# Altium project DriveBoard.PrjPcb
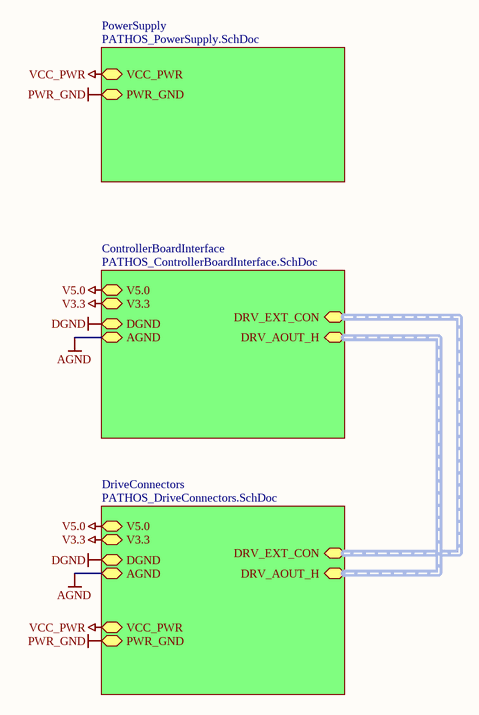
[diagram p0: PATHOS_DriveBoard.SchDoc]
5 sheets, 68 parts. Net scope: hierarchical (ports join the sheet entries above them; power ports are global).
Board file: PATHOS_DriveBoard.PcbDoc
Sheets:
  PATHOS_DriveBoard.SchDoc
    PowerSupply = PATHOS_PowerSupply.SchDoc
    ControllerBoardInterface = PATHOS_ControllerBoardInterface.SchDoc
    DriveConnectors = PATHOS_DriveConnectors.SchDoc
      Drive1 = PATHOS_Drive.SchDoc
      Drive2 = PATHOS_Drive.SchDoc
      Drive3 = PATHOS_Drive.SchDoc
      Drive4 = PATHOS_Drive.SchDoc

## Sheet PATHOS_DriveBoard.SchDoc: Drive Board for PATHOS
size A4; Author: A. Kalberer; CompanyName: NTB; DrawnBy: A. Kalberer; Organization: NTB Interstate University of Applied; Address1: Werdenbergstrasse 4; Address3: 9471 Buchs; Address4: Switzerland; DocumentNumber: 1; Revision: 0.1; SheetNumber: 1; SheetTotal: 5; Organization1: Sciences of Technology Buchs; Size: A4; ShortDescription: Main Sheet for Drive Board

### Sub-sheets
ControllerBoardInterface = PATHOS_ControllerBoardInterface.SchDoc: V5.0, V3.3, DGND, AGND, DRV_EXT_CON (harness DRV_EXT_CON), DRV_AOUT_H (harness DRV_AOUT_H)
DriveConnectors = PATHOS_DriveConnectors.SchDoc: V5.0, V3.3, DGND, AGND, VCC_PWR, PWR_GND, DRV_EXT_CON (harness DRV_EXT_CON), DRV_AOUT_H (harness DRV_AOUT_H)
PowerSupply = PATHOS_PowerSupply.SchDoc: VCC_PWR, PWR_GND

### Nets
AGND: sheet ControllerBoardInterface/AGND, sheet DriveConnectors/AGND
DGND: sheet ControllerBoardInterface/DGND, sheet DriveConnectors/DGND
PWR_GND: sheet PowerSupply/PWR_GND, sheet DriveConnectors/PWR_GND
V3.3: sheet ControllerBoardInterface/V3.3, sheet DriveConnectors/V3.3
V5.0: sheet ControllerBoardInterface/V5.0, sheet DriveConnectors/V5.0
VCC_PWR: sheet PowerSupply/VCC_PWR, sheet DriveConnectors/VCC_PWR

### Buses and harness runs
harness sheet ControllerBoardInterface/DRV_AOUT_H = sheet DriveConnectors/DRV_AOUT_H
harness sheet ControllerBoardInterface/DRV_EXT_CON = sheet DriveConnectors/DRV_EXT_CON

### Notes on the sheet
- Title:
- Description:
- Size:
- Date:
- Name:
- Number:
- Time:
- Revision:
- Sheet
- Checked:
- of
- File:

## Sheet PATHOS_PowerSupply.SchDoc: Motor/Drive Power Supply
size A4; Author: A. Kalberer; CompanyName: NTB; Organization: NTB Interstate University of Applied; Address1: Werdenbergstrasse 4; Address3: 9471 Buchs; Address4: Switzerland; DocumentNumber: 2; Revision: 0.1; SheetNumber: 2; SheetTotal: 5; Organization1: Sciences of Technology Buchs; Size: A4
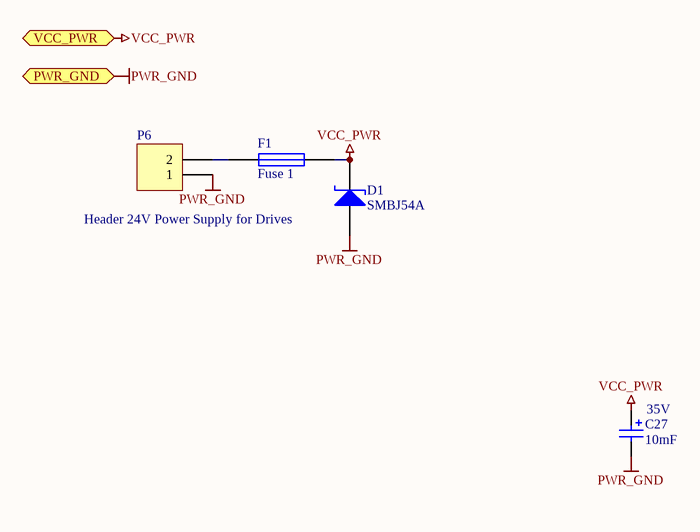
[diagram p1: PATHOS_PowerSupply.SchDoc]

### Parts
C27  Voltage Maxium: 35V  [Cap_SLP_C7_10mF]  (hidden comment: 10mF)
D1  SMBJ54A  [TVS_DO214AA]
F1  Fuse 1  [Fuse40ASMD]
P6  Header 24V Power Supply for Drives  [PhoenixHeader5_08_Vertical_unsymetric]

### Ports
PWR_GND, VCC_PWR

### Nets
PWR_GND: C27.2(Neg) D1.A P6.1 ; port PWR_GND
VCC_PWR: C27.1(Pos) D1.K F1.2 ; port VCC_PWR
NetF1_1: F1.1 P6.2

### Notes on the sheet
- Title:
- Description:
- Size:
- Date:
- Name:
- Number:
- Time:
- Revision:
- Sheet
- Checked:
- of
- File:

### Library data of the parts
C27 = C_POL: Polarized Capacitor Positive Mark Bar; #Manufacturer: Generic Components; #Publisher: Dr. A. Heinzelmann; #Class: Passive; Initial Voltage: 0V; #Published: 2006-10-07; #ClassSub: Capacitor; Type: *; Value: 10mF
D1 = Diode SMBJ54A: TVS Diode; Published: 8-Jun-2000; PackageVersion: Feb-1998; PackageReference: TO-220AC; Publisher: Altium Limited; PackageDescription: TO, Thru-Hole, Vertical, Heatsink Mounted; 3 In-Line Leads (1 Absent); Pitch 2.54 mm
F1 = Fuse 1: Fuse; Published: 8-Jun-2000; LatestRevisionDate: 17-Jul-2002; LatestRevisionNote: Re-released for DXP Platform.; PackageReference: PIN-W2/E2.8; Publisher: Altium Limited; PackageDescription: Thru-Hole; 2 Leads
P6 = Header 2: Header, 2-Pin; LatestRevisionDate: 17-Jul-2002; LatestRevisionNote: Re-released for DXP Platform.; Publisher: Altium Limited

## Sheet PATHOS_ControllerBoardInterface.SchDoc: Connector to Controller Board
size A4; Author: A. Kalberer; CompanyName: NTB; Organization: NTB Interstate University of Applied; Address1: Werdenbergstrasse 4; Address3: 9471 Buchs; Address4: Switzerland; DocumentNumber: 5; Revision: 0.1; SheetNumber: 5; SheetTotal: 5; Organization1: Sciences of Technology Buchs; Size: A4; ShortDescription: + PowerSupply for 3.3V and 5V from Controller Board
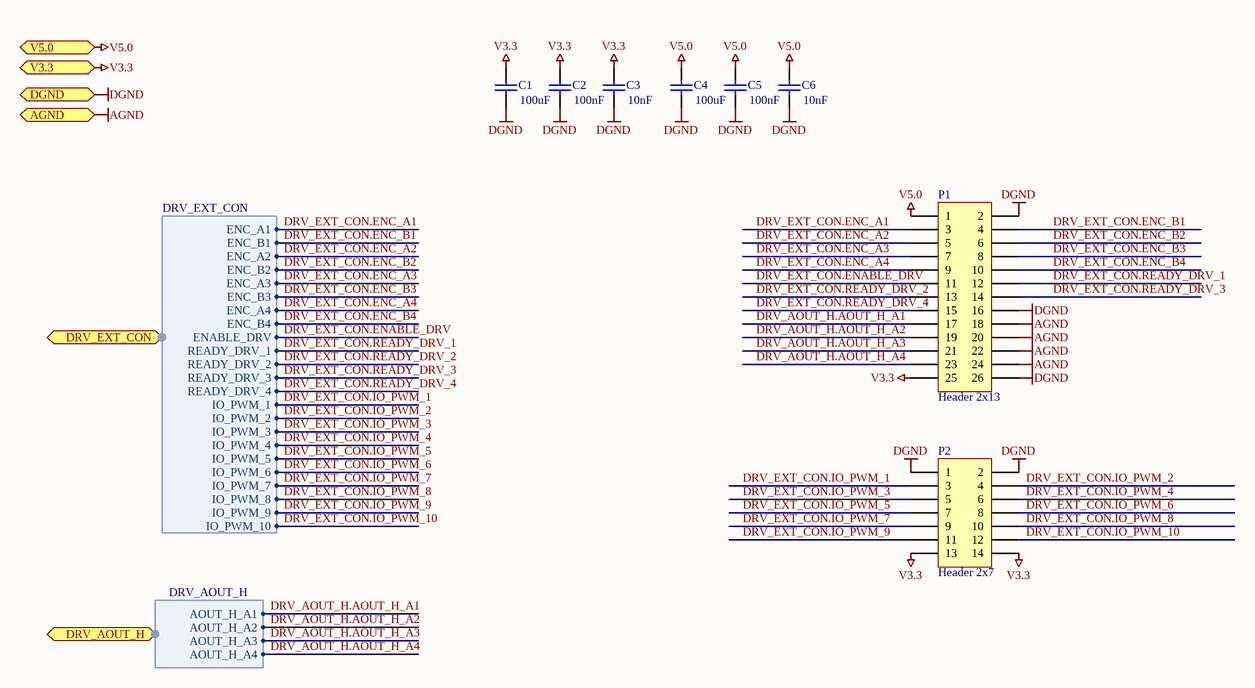
[diagram p2: PATHOS_ControllerBoardInterface.SchDoc]

### Parts
C1  value 100uF  [1812]  (hidden comment: Cap)
C2  value 100nF  [0603_3D]  (hidden comment: Cap)
C3  value 10nF  [0603_3D]  (hidden comment: Cap)
C4  value 100uF  [1812]  (hidden comment: Cap)
C5  value 100nF  [0603_3D]  (hidden comment: Cap)
C6  value 10nF  [0603_3D]  (hidden comment: Cap)
P1  Header 2x13  [Wannenstecker26Pol]
P2  Header 2x7  [Wannenstecker14Pol]

### Ports
AGND, DGND, DRV_AOUT_H (harness DRV_AOUT_H), DRV_EXT_CON (harness DRV_EXT_CON), V3.3, V5.0

### Harnesses
DRV_EXT_CON: ENC_A1, ENC_B1, ENC_A2, ENC_B2, ENC_A3, ENC_B3, ENC_A4, ENC_B4, ENABLE_DRV, IO_PWM_1, IO_PWM_2, IO_PWM_3, IO_PWM_4, IO_PWM_5, IO_PWM_6, IO_PWM_7, IO_PWM_8, READY_DRV_1, READY_DRV_2, READY_DRV_3, READY_DRV_4, IO_PWM_9, IO_PWM_10
DRV_AOUT_H: AOUT_H_A1, AOUT_H_A2, AOUT_H_A3, AOUT_H_A4

### Nets
AGND: P1.18 P1.20 P1.22 P1.24 ; port AGND
DGND: C1.1 C2.1 C3.1 C4.1 C5.1 C6.1 P1.2 P1.16 P1.26 P2.1 P2.2 ; port DGND
V3.3: C1.2 C2.2 C3.2 P1.25 P2.13 P2.14 ; port V3.3
V5.0: C4.2 C5.2 C6.2 P1.1 ; port V5.0
DRV_AOUT_H.AOUT_H_A1: P1.17 ; port DRV_AOUT_H.AOUT_H_A1  [project net DRV_AOUT_H.AOUT_H_A]
DRV_AOUT_H.AOUT_H_A2: P1.19 ; port DRV_AOUT_H.AOUT_H_A2  [project net DRV_AOUT_H.AOUT_H_A]
DRV_AOUT_H.AOUT_H_A3: P1.21 ; port DRV_AOUT_H.AOUT_H_A3  [project net DRV_AOUT_H.AOUT_H_A]
DRV_AOUT_H.AOUT_H_A4: P1.23 ; port DRV_AOUT_H.AOUT_H_A4  [project net DRV_AOUT_H.AOUT_H_A]
DRV_EXT_CON.ENABLE_DRV: P1.11 ; port DRV_EXT_CON.ENABLE_DRV
DRV_EXT_CON.ENC_A1: P1.3 ; port DRV_EXT_CON.ENC_A1
DRV_EXT_CON.ENC_A2: P1.5 ; port DRV_EXT_CON.ENC_A2
DRV_EXT_CON.ENC_A3: P1.7 ; port DRV_EXT_CON.ENC_A3
DRV_EXT_CON.ENC_A4: P1.9 ; port DRV_EXT_CON.ENC_A4
DRV_EXT_CON.ENC_B1: P1.4 ; port DRV_EXT_CON.ENC_B1
DRV_EXT_CON.ENC_B2: P1.6 ; port DRV_EXT_CON.ENC_B2
DRV_EXT_CON.ENC_B3: P1.8 ; port DRV_EXT_CON.ENC_B3
DRV_EXT_CON.ENC_B4: P1.10 ; port DRV_EXT_CON.ENC_B4
DRV_EXT_CON.IO_PWM_1: P2.3 ; port DRV_EXT_CON.IO_PWM_1
DRV_EXT_CON.IO_PWM_2: P2.4 ; port DRV_EXT_CON.IO_PWM_2
DRV_EXT_CON.IO_PWM_3: P2.5 ; port DRV_EXT_CON.IO_PWM_3
DRV_EXT_CON.IO_PWM_4: P2.6 ; port DRV_EXT_CON.IO_PWM_4
DRV_EXT_CON.IO_PWM_5: P2.7 ; port DRV_EXT_CON.IO_PWM_5
DRV_EXT_CON.IO_PWM_6: P2.8 ; port DRV_EXT_CON.IO_PWM_6
DRV_EXT_CON.IO_PWM_7: P2.9 ; port DRV_EXT_CON.IO_PWM_7
DRV_EXT_CON.IO_PWM_8: P2.10 ; port DRV_EXT_CON.IO_PWM_8
DRV_EXT_CON.IO_PWM_9: P2.11 ; port DRV_EXT_CON.IO_PWM_9
DRV_EXT_CON.IO_PWM_10: P2.12 ; port DRV_EXT_CON.IO_PWM_10
DRV_EXT_CON.READY_DRV_1: P1.12 ; port DRV_EXT_CON.READY_DRV_1
DRV_EXT_CON.READY_DRV_2: P1.13 ; port DRV_EXT_CON.READY_DRV_2
DRV_EXT_CON.READY_DRV_3: P1.14 ; port DRV_EXT_CON.READY_DRV_3
DRV_EXT_CON.READY_DRV_4: P1.15 ; port DRV_EXT_CON.READY_DRV_4

### Notes on the sheet
- Title:
- Description:
- Size:
- Date:
- Name:
- Number:
- Time:
- Revision:
- Sheet
- Checked:
- of
- File:

### Library data of the parts
C1-C6 = Cap: Capacitor; Published: 8-Jun-2000; LatestRevisionDate: 17-Jul-2002; LatestRevisionNote: Re-released for DXP Platform.; PackageReference: RAD-0.3; Publisher: Altium Limited; PackageDescription: Radial Cap, Thru-Hole; 2 Leads; 0.3 in Pin Spacing
P1 = Header 2x13: Header, 13-Pin, Dual row; LatestRevisionDate: 17-Jul-2002; LatestRevisionNote: Re-released for DXP Platform.; Publisher: Altium Limited
P2 = Header 2x7: Header, 7-Pin, Dual row; LatestRevisionDate: 17-Jul-2002; LatestRevisionNote: Re-released for DXP Platform.; Publisher: Altium Limited

## Sheet PATHOS_DriveConnectors.SchDoc: Drive Signal Distribution
size A4; Author: A. Kalberer; CompanyName: NTB; Organization: NTB Interstate University of Applied; Address1: Werdenbergstrasse 4; Address3: 9471 Buchs; Address4: Switzerland; DocumentNumber: 3; Revision: 0.1; SheetNumber: 3; SheetTotal: 5; Organization1: Sciences of Technology Buchs; Size: A4; ShortDescription: Level Shifter and Line Receiver for Drive Connector
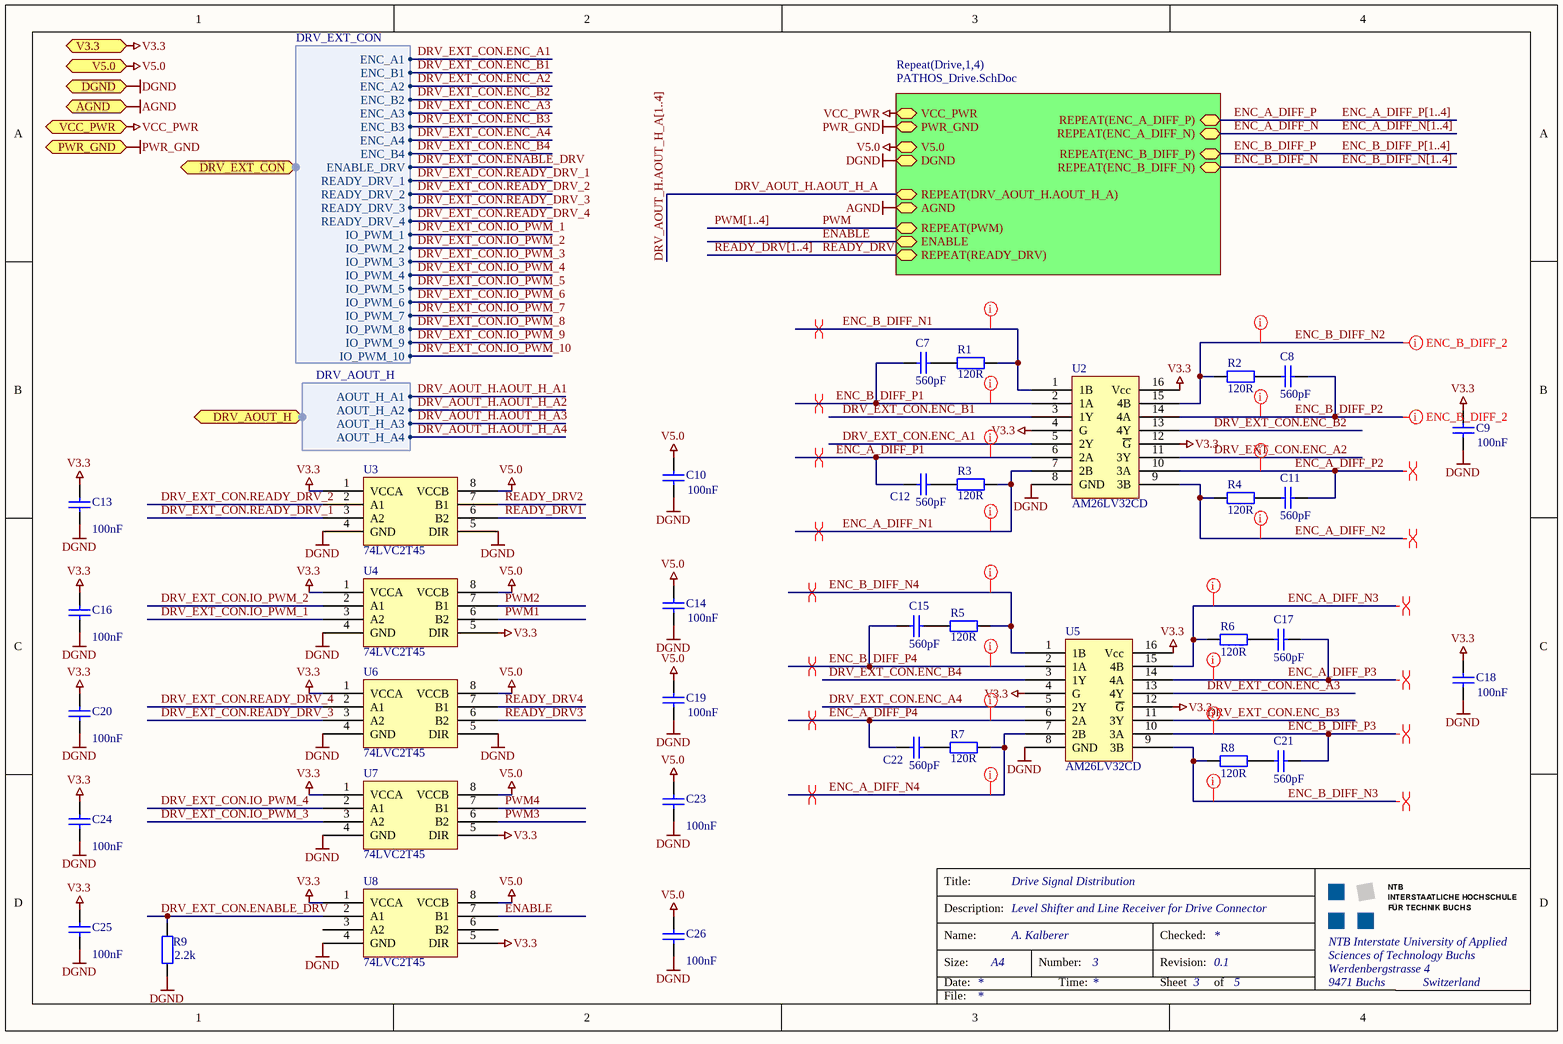
[diagram p3: PATHOS_DriveConnectors.SchDoc]

### Parts
C7  value 560pF  [0603_3D]  (hidden comment: Cap)
C8  value 560pF  [0603_3D]  (hidden comment: Cap)
C9  value 100nF  [0603_3D]  (hidden comment: Cap)
C10  value 100nF  [0603_3D]  (hidden comment: Cap)
C11  value 560pF  [0603_3D]  (hidden comment: Cap)
C12  value 560pF  [0603_3D]  (hidden comment: Cap)
C13  value 100nF  [0603_3D]  (hidden comment: Cap)
C14  value 100nF  [0603_3D]  (hidden comment: Cap)
C15  value 560pF  [0603_3D]  (hidden comment: Cap)
C16  value 100nF  [0603_3D]  (hidden comment: Cap)
C17  value 560pF  [0603_3D]  (hidden comment: Cap)
C18  value 100nF  [0603_3D]  (hidden comment: Cap)
C19  value 100nF  [0603_3D]  (hidden comment: Cap)
C20  value 100nF  [0603_3D]  (hidden comment: Cap)
C21  value 560pF  [0603_3D]  (hidden comment: Cap)
C22  value 560pF  [0603_3D]  (hidden comment: Cap)
C23  value 100nF  [0603_3D]  (hidden comment: Cap)
C24  value 100nF  [0603_3D]  (hidden comment: Cap)
C25  value 100nF  [0603_3D]  (hidden comment: Cap)
C26  value 100nF  [0603_3D]  (hidden comment: Cap)
R1  value 120R  [0603_3D]  (hidden comment: Res2)
R2  value 120R  [0603_3D]  (hidden comment: Res2)
R3  value 120R  [0603_3D]  (hidden comment: Res2)
R4  value 120R  [0603_3D]  (hidden comment: Res2)
R5  value 120R  [0603_3D]  (hidden comment: Res2)
R6  value 120R  [0603_3D]  (hidden comment: Res2)
R7  value 120R  [0603_3D]  (hidden comment: Res2)
R8  value 120R  [0603_3D]  (hidden comment: Res2)
R9  value 2.2k  [0603_3D]  (hidden comment: Res2)
U2  AM26LV32CD  [SOP16]
U3  74LVC2T45  [74LVC2T45]
U4  74LVC2T45  [74LVC2T45]
U5  AM26LV32CD  [SOP16]
U6  74LVC2T45  [74LVC2T45]
U7  74LVC2T45  [74LVC2T45]
U8  74LVC2T45  [74LVC2T45]

### Sub-sheets
Repeat(Drive,1,4) = PATHOS_Drive.SchDoc: VCC_PWR, PWR_GND, V5.0, DGND, REPEAT(DRV_AOUT_H.AOUT_H_A), AGND, REPEAT(ENC_A_DIFF_P), REPEAT(ENC_A_DIFF_N), REPEAT(ENC_B_DIFF_P), REPEAT(ENC_B_DIFF_N), REPEAT(PWM), ENABLE, REPEAT(READY_DRV)

### Ports
AGND, DGND, DRV_AOUT_H (harness DRV_AOUT_H), DRV_EXT_CON (harness DRV_EXT_CON), PWR_GND, V3.3, V5.0, VCC_PWR

### Harnesses
DRV_EXT_CON: ENC_A1, ENC_B1, ENC_A2, ENC_B2, ENC_A3, ENC_B3, ENC_A4, ENC_B4, ENABLE_DRV, IO_PWM_1, IO_PWM_2, IO_PWM_3, IO_PWM_4, IO_PWM_5, IO_PWM_6, IO_PWM_7, IO_PWM_8, READY_DRV_1, READY_DRV_2, READY_DRV_3, READY_DRV_4, IO_PWM_9, IO_PWM_10
DRV_AOUT_H: AOUT_H_A1, AOUT_H_A2, AOUT_H_A3, AOUT_H_A4

### Nets
AGND: port AGND, sheet Repeat(Drive,1,4)/AGND
DGND: C9.1 C10.1 C13.1 C14.1 C16.1 C18.1 C19.1 C20.1 C23.1 C24.1 C25.1 C26.1 R9.1 U2.8(GND) U3.4(GND) U3.5(DIR) U4.4(GND) U5.8(GND) U6.4(GND) U6.5(DIR) U7.4(GND) U8.4(GND) ; port DGND, sheet Repeat(Drive,1,4)/DGND
PWR_GND: port PWR_GND, sheet Repeat(Drive,1,4)/PWR_GND
V3.3: C9.2 C13.2 C16.2 C18.2 C20.2 C24.2 C25.2 U2.4(G) U2.12(~{G}) U2.16(Vcc) U3.1(VCCA) U4.1(VCCA) U4.5(DIR) U5.4(G) U5.12(~{G}) U5.16(Vcc) U6.1(VCCA) U7.1(VCCA) U7.5(DIR) U8.1(VCCA) U8.5(DIR) ; port V3.3
V5.0: C10.2 C14.2 C19.2 C23.2 C26.2 U3.8(VCCB) U4.8(VCCB) U6.8(VCCB) U7.8(VCCB) U8.8(VCCB) ; port V5.0, sheet Repeat(Drive,1,4)/V5.0
VCC_PWR: port VCC_PWR, sheet Repeat(Drive,1,4)/VCC_PWR
DRV_AOUT_H.AOUT_H_A: sheet Repeat(Drive,1,4)/REPEAT(DRV_AOUT_H.AOUT_H_A)
DRV_EXT_CON.ENABLE_DRV: R9.2 U8.2(A1) ; port DRV_EXT_CON.ENABLE_DRV
DRV_EXT_CON.ENC_A1: U2.5(2Y) ; port DRV_EXT_CON.ENC_A1
DRV_EXT_CON.ENC_A2: U2.11(3Y) ; port DRV_EXT_CON.ENC_A2
DRV_EXT_CON.ENC_A3: U5.13(4Y) ; port DRV_EXT_CON.ENC_A3
DRV_EXT_CON.ENC_A4: U5.5(2Y) ; port DRV_EXT_CON.ENC_A4
DRV_EXT_CON.ENC_B1: U2.3(1Y) ; port DRV_EXT_CON.ENC_B1
DRV_EXT_CON.ENC_B2: U2.13(4Y) ; port DRV_EXT_CON.ENC_B2
DRV_EXT_CON.ENC_B3: U5.11(3Y) ; port DRV_EXT_CON.ENC_B3
DRV_EXT_CON.ENC_B4: U5.3(1Y) ; port DRV_EXT_CON.ENC_B4
DRV_EXT_CON.IO_PWM_1: U4.3(A2) ; port DRV_EXT_CON.IO_PWM_1
DRV_EXT_CON.IO_PWM_2: U4.2(A1) ; port DRV_EXT_CON.IO_PWM_2
DRV_EXT_CON.IO_PWM_3: U7.3(A2) ; port DRV_EXT_CON.IO_PWM_3
DRV_EXT_CON.IO_PWM_4: U7.2(A1) ; port DRV_EXT_CON.IO_PWM_4
DRV_EXT_CON.READY_DRV_1: U3.3(A2) ; port DRV_EXT_CON.READY_DRV_1
DRV_EXT_CON.READY_DRV_2: U3.2(A1) ; port DRV_EXT_CON.READY_DRV_2
DRV_EXT_CON.READY_DRV_3: U6.3(A2) ; port DRV_EXT_CON.READY_DRV_3
DRV_EXT_CON.READY_DRV_4: U6.2(A1) ; port DRV_EXT_CON.READY_DRV_4
ENABLE: U8.7(B1) ; sheet Repeat(Drive,1,4)/ENABLE
ENC_A_DIFF_N: sheet Repeat(Drive,1,4)/REPEAT(ENC_A_DIFF_N)
ENC_A_DIFF_N1: R3.1 U2.7(2B)  [project net ENC_A_DIFF_N]
ENC_A_DIFF_N2: R4.1 U2.9(3B)  [project net ENC_A_DIFF_N]
ENC_A_DIFF_N3: R6.1 U5.15(4B)  [project net ENC_A_DIFF_N]
ENC_A_DIFF_N4: R7.1 U5.7(2B)  [project net ENC_A_DIFF_N]
ENC_A_DIFF_P: sheet Repeat(Drive,1,4)/REPEAT(ENC_A_DIFF_P)
ENC_A_DIFF_P1: C12.2 U2.6(2A)  [project net ENC_A_DIFF_P]
ENC_A_DIFF_P2: C11.1 U2.10(3A)  [project net ENC_A_DIFF_P]
ENC_A_DIFF_P3: C17.1 U5.14(4A)  [project net ENC_A_DIFF_P]
ENC_A_DIFF_P4: C22.2 U5.6(2A)  [project net ENC_A_DIFF_P]
ENC_B_DIFF_N: sheet Repeat(Drive,1,4)/REPEAT(ENC_B_DIFF_N)
ENC_B_DIFF_N1: R1.1 U2.1(1B)  [project net ENC_B_DIFF_N]
ENC_B_DIFF_N2: R2.1 U2.15(4B)  [project net ENC_B_DIFF_N]
ENC_B_DIFF_N3: R8.1 U5.9(3B)  [project net ENC_B_DIFF_N]
ENC_B_DIFF_N4: R5.1 U5.1(1B)  [project net ENC_B_DIFF_N]
ENC_B_DIFF_P: sheet Repeat(Drive,1,4)/REPEAT(ENC_B_DIFF_P)
ENC_B_DIFF_P1: C7.2 U2.2(1A)  [project net ENC_B_DIFF_P]
ENC_B_DIFF_P2: C8.1 U2.14(4A)  [project net ENC_B_DIFF_P]
ENC_B_DIFF_P3: C21.1 U5.10(3A)  [project net ENC_B_DIFF_P]
ENC_B_DIFF_P4: C15.2 U5.2(1A)  [project net ENC_B_DIFF_P]
PWM: sheet Repeat(Drive,1,4)/REPEAT(PWM)
PWM1: U4.6(B2)  [project net PWM]
PWM2: U4.7(B1)  [project net PWM]
PWM3: U7.6(B2)  [project net PWM]
PWM4: U7.7(B1)  [project net PWM]
READY_DRV: sheet Repeat(Drive,1,4)/REPEAT(READY_DRV)
READY_DRV1: U3.6(B2)  [project net READY_DRV]
READY_DRV2: U3.7(B1)  [project net READY_DRV]
READY_DRV3: U6.6(B2)  [project net READY_DRV]
READY_DRV4: U6.7(B1)  [project net READY_DRV]
NetC7_1: C7.1 R1.2
NetC8_2: C8.2 R2.2
NetC11_2: C11.2 R4.2
NetC12_1: C12.1 R3.2
NetC15_1: C15.1 R5.2
NetC17_2: C17.2 R6.2
NetC21_2: C21.2 R8.2
NetC22_1: C22.1 R7.2

Not connected (* = marked no-connect by the designer): U8 3(A2) 6(B2)

### Buses and harness runs
bus DRV_AOUT_H.AOUT_H_A[1..4]
bus ENC_A_DIFF_N[1..4]
bus ENC_A_DIFF_P[1..4]
bus ENC_B_DIFF_N[1..4]
bus ENC_B_DIFF_P[1..4]
bus PWM[1..4]
bus READY_DRV[1..4]

### Layout directives
differential pair: ENC_A_DIFF_N, ENC_A_DIFF_P, ENC_B_DIFF_N, ENC_B_DIFF_P
net class ENC_A_DIFF_1: ENC_A_DIFF_N, ENC_A_DIFF_P
net class ENC_B_DIFF_1: ENC_B_DIFF_N, ENC_B_DIFF_P
net class ENC_A_DIFF_2: ENC_A_DIFF_N, ENC_A_DIFF_P
net class ENC_B_DIFF_2: ENC_B_DIFF_N, ENC_B_DIFF_P
net class ENC_B_DIFF_4: ENC_B_DIFF_N, ENC_B_DIFF_P
net class ENC_A_DIFF_4: ENC_A_DIFF_N, ENC_A_DIFF_P
net class ENC_B_DIFF_3: ENC_B_DIFF_N, ENC_B_DIFF_P
net class ENC_A_DIFF_3: ENC_A_DIFF_N, ENC_A_DIFF_P

### Notes on the sheet
- Title:
- Description:
- Size:
- Date:
- Name:
- Number:
- Time:
- Revision:
- Sheet
- Checked:
- of
- File:

### Library data of the parts
C7-C26 = Cap: Capacitor; Published: 8-Jun-2000; LatestRevisionDate: 17-Jul-2002; LatestRevisionNote: Re-released for DXP Platform.; PackageReference: RAD-0.3; Publisher: Altium Limited; PackageDescription: Radial Cap, Thru-Hole; 2 Leads; 0.3 in Pin Spacing
R1-R9 = Res2: Resistor; Published: 8-Jun-2000; LatestRevisionDate: 17-Jul-2002; LatestRevisionNote: Re-released for DXP Platform.; PackageReference: AXIAL-0.4; Publisher: Altium Limited; PackageDescription: Axial Device, Thru-Hole; 2 Leads; 0.4 in Pin Spacing
U3 U4 U6-U8 = 74LVC2T45: SN74LVC2T45DCTR

## Sheet PATHOS_Drive.SchDoc: Maxon Drive Connector
size A4; Author: A. Kalberer; CompanyName: NTB; Organization: NTB Interstate University of Applied; Address1: Werdenbergstrasse 4; Address3: 9471 Buchs; Address4: Switzerland; DocumentNumber: 4; Revision: 0.1; SheetNumber: 4; SheetTotal: 5; Organization1: Sciences of Technology Buchs; Size: A4; ShortDescription: Connector for ESCON 50/5
Used 4 times, as channels DriveConnectors/Drive1, DriveConnectors/Drive2, DriveConnectors/Drive3, DriveConnectors/Drive4. Parts and nets are listed once, with the designators drawn on the sheet.
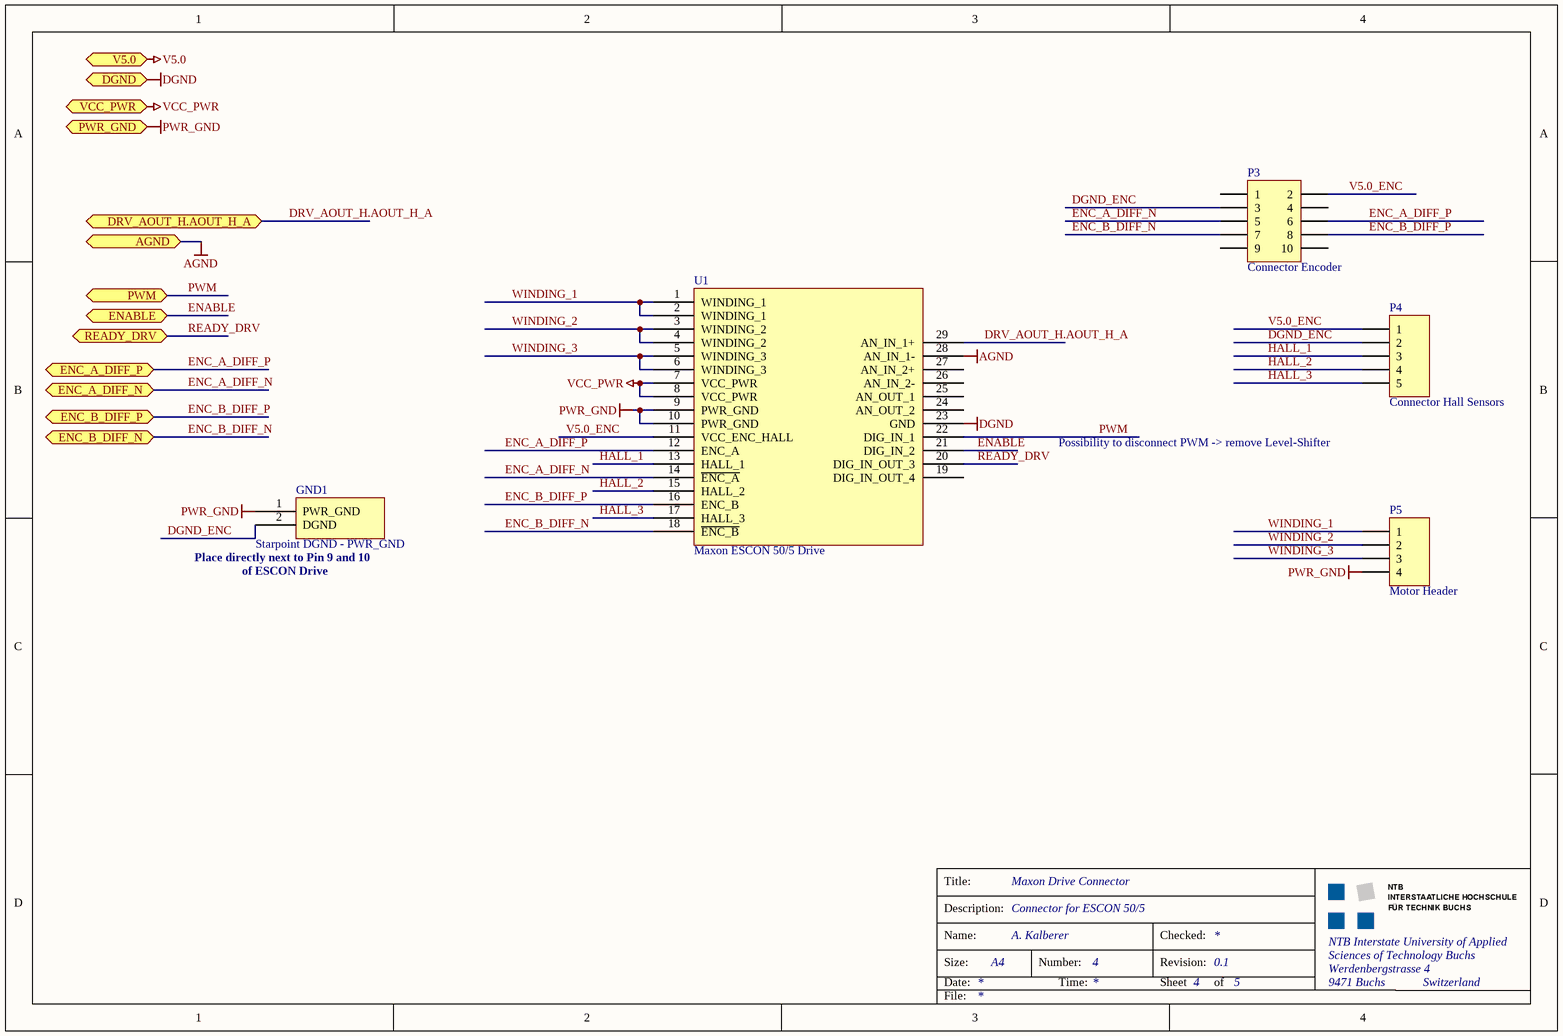
[diagram p4: PATHOS_Drive.SchDoc]

### Parts
GND1  Starpoint DGND - PWR_GND  [NetTiePWRGND]  (net tie, no BOM)
P3  Connector Encoder  [Wannenstecker 2x5 - H]
P4  Connector Hall Sensors  [PhoenixHeaderScrew_3_5mm_5pol]
P5  Motor Header  [PhoenixHeaderScrew_3_5mm_4pol]
U1  Maxon ESCON 50/5 Drive  [ESCON_MODULE_50/5]

### Ports
AGND, DGND, DRV_AOUT_H.AOUT_H_A, ENABLE, ENC_A_DIFF_N, ENC_A_DIFF_P, ENC_B_DIFF_N, ENC_B_DIFF_P, PWM, PWR_GND, READY_DRV, V5.0, VCC_PWR

### Nets
AGND: U1.28(AN_IN_1-) ; port AGND
DGND: U1.23(GND) ; port DGND
PWR_GND: GND1.1(PWR_GND) P5.4 U1.9(PWR_GND) U1.10(PWR_GND) ; port PWR_GND
V5.0: port V5.0
VCC_PWR: U1.7(VCC_PWR) U1.8(VCC_PWR) ; port VCC_PWR
DGND_ENC: GND1.2(DGND) P3.3 P4.2
DRV_AOUT_H.AOUT_H_A: U1.29(AN_IN_1+) ; port DRV_AOUT_H.AOUT_H_A
ENABLE: U1.21(DIG_IN_2) ; port ENABLE
ENC_A_DIFF_N: P3.5 U1.14(~{ENC_A}) ; port ENC_A_DIFF_N
ENC_A_DIFF_P: P3.6 U1.12(ENC_A) ; port ENC_A_DIFF_P
ENC_B_DIFF_N: P3.7 U1.18(~{ENC_B}) ; port ENC_B_DIFF_N
ENC_B_DIFF_P: P3.8 U1.16(ENC_B) ; port ENC_B_DIFF_P
HALL_1: P4.3 U1.13(HALL_1)
HALL_2: P4.4 U1.15(HALL_2)
HALL_3: P4.5 U1.17(HALL_3)
PWM: U1.22(DIG_IN_1) ; port PWM
READY_DRV: U1.20(DIG_IN_OUT_3) ; port READY_DRV
V5.0_ENC: P3.2 P4.1 U1.11(VCC_ENC_HALL)
WINDING_1: P5.1 U1.1(WINDING_1) U1.2(WINDING_1)
WINDING_2: P5.2 U1.3(WINDING_2) U1.4(WINDING_2)
WINDING_3: P5.3 U1.5(WINDING_3) U1.6(WINDING_3)

Not connected (* = marked no-connect by the designer): P3 1 4 9 10; U1 19(DIG_IN_OUT_4) 24(AN_OUT_2) 25(AN_OUT_1) 26(AN_IN_2-) 27(AN_IN_2+)

### Channels
DriveConnectors/Drive1: designators end in _Drive1; ports AGND=AGND DGND=DGND DRV_AOUT_H.AOUT_H_A=DRV_AOUT_H.AOUT_H_A ENABLE=ENABLE ENC_A_DIFF_N=ENC_A_DIFF_N ENC_A_DIFF_P=ENC_A_DIFF_P ENC_B_DIFF_N=ENC_B_DIFF_N ENC_B_DIFF_P=ENC_B_DIFF_P PWM=PWM PWR_GND=PWR_GND READY_DRV=READY_DRV V5.0=V5.0 VCC_PWR=VCC_PWR
DriveConnectors/Drive2: designators end in _Drive2; ports AGND=AGND DGND=DGND DRV_AOUT_H.AOUT_H_A=DRV_AOUT_H.AOUT_H_A ENABLE=ENABLE ENC_A_DIFF_N=ENC_A_DIFF_N ENC_A_DIFF_P=ENC_A_DIFF_P ENC_B_DIFF_N=ENC_B_DIFF_N ENC_B_DIFF_P=ENC_B_DIFF_P PWM=PWM PWR_GND=PWR_GND READY_DRV=READY_DRV V5.0=V5.0 VCC_PWR=VCC_PWR
DriveConnectors/Drive3: designators end in _Drive3; ports AGND=AGND DGND=DGND DRV_AOUT_H.AOUT_H_A=DRV_AOUT_H.AOUT_H_A ENABLE=ENABLE ENC_A_DIFF_N=ENC_A_DIFF_N ENC_A_DIFF_P=ENC_A_DIFF_P ENC_B_DIFF_N=ENC_B_DIFF_N ENC_B_DIFF_P=ENC_B_DIFF_P PWM=PWM PWR_GND=PWR_GND READY_DRV=READY_DRV V5.0=V5.0 VCC_PWR=VCC_PWR
DriveConnectors/Drive4: designators end in _Drive4; ports AGND=AGND DGND=DGND DRV_AOUT_H.AOUT_H_A=DRV_AOUT_H.AOUT_H_A ENABLE=ENABLE ENC_A_DIFF_N=ENC_A_DIFF_N ENC_A_DIFF_P=ENC_A_DIFF_P ENC_B_DIFF_N=ENC_B_DIFF_N ENC_B_DIFF_P=ENC_B_DIFF_P PWM=PWM PWR_GND=PWR_GND READY_DRV=READY_DRV V5.0=V5.0 VCC_PWR=VCC_PWR

### Notes on the sheet
- Possibility to disconnect PWM -> remove Level-Shifter
- (near GND1) Place directly next to Pin 9 and 10
- (near GND1) of ESCON Drive
- Title:
- Description:
- Size:
- Date:
- Name:
- Number:
- Time:
- Revision:
- Sheet
- Checked:
- of
- File:

### Library data of the parts
GND1 = NetTie_PWR_GND
P3 = Header 5X2: Header, 5-Pin, Dual row; LatestRevisionDate: 17-Jul-2002; LatestRevisionNote: Re-released for DXP Platform.; Publisher: Altium Limited
P4 = Header 5: Header, 5-Pin; LatestRevisionDate: 17-Jul-2002; LatestRevisionNote: Re-released for DXP Platform.; Publisher: Altium Limited
P5 = Header 4: Header, 4-Pin; LatestRevisionDate: 17-Jul-2002; LatestRevisionNote: Re-released for DXP Platform.; Publisher: Altium Limited
U1 = DRV_ESCON_50_5: Maxon Drive 4Q

## Nets that join several sheets
AGND: PATHOS_ControllerBoardInterface (P1.18 P1.20 P1.22 P1.24), DriveConnectors/Drive1 (U1_Drive1.28), DriveConnectors/Drive2 (U1_Drive2.28), DriveConnectors/Drive3 (U1_Drive3.28), DriveConnectors/Drive4 (U1_Drive4.28)
DGND: PATHOS_ControllerBoardInterface (11 pins), PATHOS_DriveConnectors (22 pins), DriveConnectors/Drive1 (U1_Drive1.23), DriveConnectors/Drive2 (U1_Drive2.23), DriveConnectors/Drive3 (U1_Drive3.23), DriveConnectors/Drive4 (U1_Drive4.23)
PWR_GND: PATHOS_PowerSupply (C27.2 D1.A P6.1), DriveConnectors/Drive1 (GND1_Drive1.1 P5_Drive1.4 U1_Drive1.9 U1_Drive1.10), DriveConnectors/Drive2 (GND1_Drive2.1 P5_Drive2.4 U1_Drive2.9 U1_Drive2.10), DriveConnectors/Drive3 (GND1_Drive3.1 P5_Drive3.4 U1_Drive3.9 U1_Drive3.10), DriveConnectors/Drive4 (GND1_Drive4.1 P5_Drive4.4 U1_Drive4.9 U1_Drive4.10)
V3.3: PATHOS_ControllerBoardInterface (6 pins), PATHOS_DriveConnectors (21 pins)
V5.0: PATHOS_ControllerBoardInterface (C4.2 C5.2 C6.2 P1.1), PATHOS_DriveConnectors (10 pins)
VCC_PWR: PATHOS_PowerSupply (C27.1 D1.K F1.2), DriveConnectors/Drive1 (U1_Drive1.7 U1_Drive1.8), DriveConnectors/Drive2 (U1_Drive2.7 U1_Drive2.8), DriveConnectors/Drive3 (U1_Drive3.7 U1_Drive3.8), DriveConnectors/Drive4 (U1_Drive4.7 U1_Drive4.8)
DRV_AOUT_H.AOUT_H_A: PATHOS_ControllerBoardInterface (P1.17), DriveConnectors/Drive1 (U1_Drive1.29)
DRV_AOUT_H.AOUT_H_A: PATHOS_ControllerBoardInterface (P1.19), DriveConnectors/Drive2 (U1_Drive2.29)
DRV_AOUT_H.AOUT_H_A: PATHOS_ControllerBoardInterface (P1.21), DriveConnectors/Drive3 (U1_Drive3.29)
DRV_AOUT_H.AOUT_H_A: PATHOS_ControllerBoardInterface (P1.23), DriveConnectors/Drive4 (U1_Drive4.29)
DRV_EXT_CON.ENABLE_DRV: PATHOS_ControllerBoardInterface (P1.11), PATHOS_DriveConnectors (R9.2 U8.2)
DRV_EXT_CON.ENC_A1: PATHOS_ControllerBoardInterface (P1.3), PATHOS_DriveConnectors (U2.5)
DRV_EXT_CON.ENC_A2: PATHOS_ControllerBoardInterface (P1.5), PATHOS_DriveConnectors (U2.11)
DRV_EXT_CON.ENC_A3: PATHOS_ControllerBoardInterface (P1.7), PATHOS_DriveConnectors (U5.13)
DRV_EXT_CON.ENC_A4: PATHOS_ControllerBoardInterface (P1.9), PATHOS_DriveConnectors (U5.5)
DRV_EXT_CON.ENC_B1: PATHOS_ControllerBoardInterface (P1.4), PATHOS_DriveConnectors (U2.3)
DRV_EXT_CON.ENC_B2: PATHOS_ControllerBoardInterface (P1.6), PATHOS_DriveConnectors (U2.13)
DRV_EXT_CON.ENC_B3: PATHOS_ControllerBoardInterface (P1.8), PATHOS_DriveConnectors (U5.11)
DRV_EXT_CON.ENC_B4: PATHOS_ControllerBoardInterface (P1.10), PATHOS_DriveConnectors (U5.3)
DRV_EXT_CON.IO_PWM_1: PATHOS_ControllerBoardInterface (P2.3), PATHOS_DriveConnectors (U4.3)
DRV_EXT_CON.IO_PWM_2: PATHOS_ControllerBoardInterface (P2.4), PATHOS_DriveConnectors (U4.2)
DRV_EXT_CON.IO_PWM_3: PATHOS_ControllerBoardInterface (P2.5), PATHOS_DriveConnectors (U7.3)
DRV_EXT_CON.IO_PWM_4: PATHOS_ControllerBoardInterface (P2.6), PATHOS_DriveConnectors (U7.2)
DRV_EXT_CON.READY_DRV_1: PATHOS_ControllerBoardInterface (P1.12), PATHOS_DriveConnectors (U3.3)
DRV_EXT_CON.READY_DRV_2: PATHOS_ControllerBoardInterface (P1.13), PATHOS_DriveConnectors (U3.2)
DRV_EXT_CON.READY_DRV_3: PATHOS_ControllerBoardInterface (P1.14), PATHOS_DriveConnectors (U6.3)
DRV_EXT_CON.READY_DRV_4: PATHOS_ControllerBoardInterface (P1.15), PATHOS_DriveConnectors (U6.2)
ENABLE: PATHOS_DriveConnectors (U8.7), DriveConnectors/Drive1 (U1_Drive1.21), DriveConnectors/Drive2 (U1_Drive2.21), DriveConnectors/Drive3 (U1_Drive3.21), DriveConnectors/Drive4 (U1_Drive4.21)
ENC_A_DIFF_N: PATHOS_DriveConnectors (R3.1 U2.7), DriveConnectors/Drive1 (P3_Drive1.5 U1_Drive1.14)
ENC_A_DIFF_N: PATHOS_DriveConnectors (R4.1 U2.9), DriveConnectors/Drive2 (P3_Drive2.5 U1_Drive2.14)
ENC_A_DIFF_N: PATHOS_DriveConnectors (R7.1 U5.7), DriveConnectors/Drive4 (P3_Drive4.5 U1_Drive4.14)
ENC_A_DIFF_N: PATHOS_DriveConnectors (R6.1 U5.15), DriveConnectors/Drive3 (P3_Drive3.5 U1_Drive3.14)
ENC_A_DIFF_P: PATHOS_DriveConnectors (C12.2 U2.6), DriveConnectors/Drive1 (P3_Drive1.6 U1_Drive1.12)
ENC_A_DIFF_P: PATHOS_DriveConnectors (C11.1 U2.10), DriveConnectors/Drive2 (P3_Drive2.6 U1_Drive2.12)
ENC_A_DIFF_P: PATHOS_DriveConnectors (C22.2 U5.6), DriveConnectors/Drive4 (P3_Drive4.6 U1_Drive4.12)
ENC_A_DIFF_P: PATHOS_DriveConnectors (C17.1 U5.14), DriveConnectors/Drive3 (P3_Drive3.6 U1_Drive3.12)
ENC_B_DIFF_N: PATHOS_DriveConnectors (R1.1 U2.1), DriveConnectors/Drive1 (P3_Drive1.7 U1_Drive1.18)
ENC_B_DIFF_N: PATHOS_DriveConnectors (R2.1 U2.15), DriveConnectors/Drive2 (P3_Drive2.7 U1_Drive2.18)
ENC_B_DIFF_N: PATHOS_DriveConnectors (R5.1 U5.1), DriveConnectors/Drive4 (P3_Drive4.7 U1_Drive4.18)
ENC_B_DIFF_N: PATHOS_DriveConnectors (R8.1 U5.9), DriveConnectors/Drive3 (P3_Drive3.7 U1_Drive3.18)
ENC_B_DIFF_P: PATHOS_DriveConnectors (C7.2 U2.2), DriveConnectors/Drive1 (P3_Drive1.8 U1_Drive1.16)
ENC_B_DIFF_P: PATHOS_DriveConnectors (C8.1 U2.14), DriveConnectors/Drive2 (P3_Drive2.8 U1_Drive2.16)
ENC_B_DIFF_P: PATHOS_DriveConnectors (C15.2 U5.2), DriveConnectors/Drive4 (P3_Drive4.8 U1_Drive4.16)
ENC_B_DIFF_P: PATHOS_DriveConnectors (C21.1 U5.10), DriveConnectors/Drive3 (P3_Drive3.8 U1_Drive3.16)
PWM: PATHOS_DriveConnectors (U4.6), DriveConnectors/Drive1 (U1_Drive1.22)
PWM: PATHOS_DriveConnectors (U4.7), DriveConnectors/Drive2 (U1_Drive2.22)
PWM: PATHOS_DriveConnectors (U7.6), DriveConnectors/Drive3 (U1_Drive3.22)
PWM: PATHOS_DriveConnectors (U7.7), DriveConnectors/Drive4 (U1_Drive4.22)
READY_DRV: PATHOS_DriveConnectors (U3.6), DriveConnectors/Drive1 (U1_Drive1.20)
READY_DRV: PATHOS_DriveConnectors (U3.7), DriveConnectors/Drive2 (U1_Drive2.20)
READY_DRV: PATHOS_DriveConnectors (U6.6), DriveConnectors/Drive3 (U1_Drive3.20)
READY_DRV: PATHOS_DriveConnectors (U6.7), DriveConnectors/Drive4 (U1_Drive4.20)